# Altium schematic sheet P5_CCD_CAM_BOARD_AFE.SchDoc
size A3
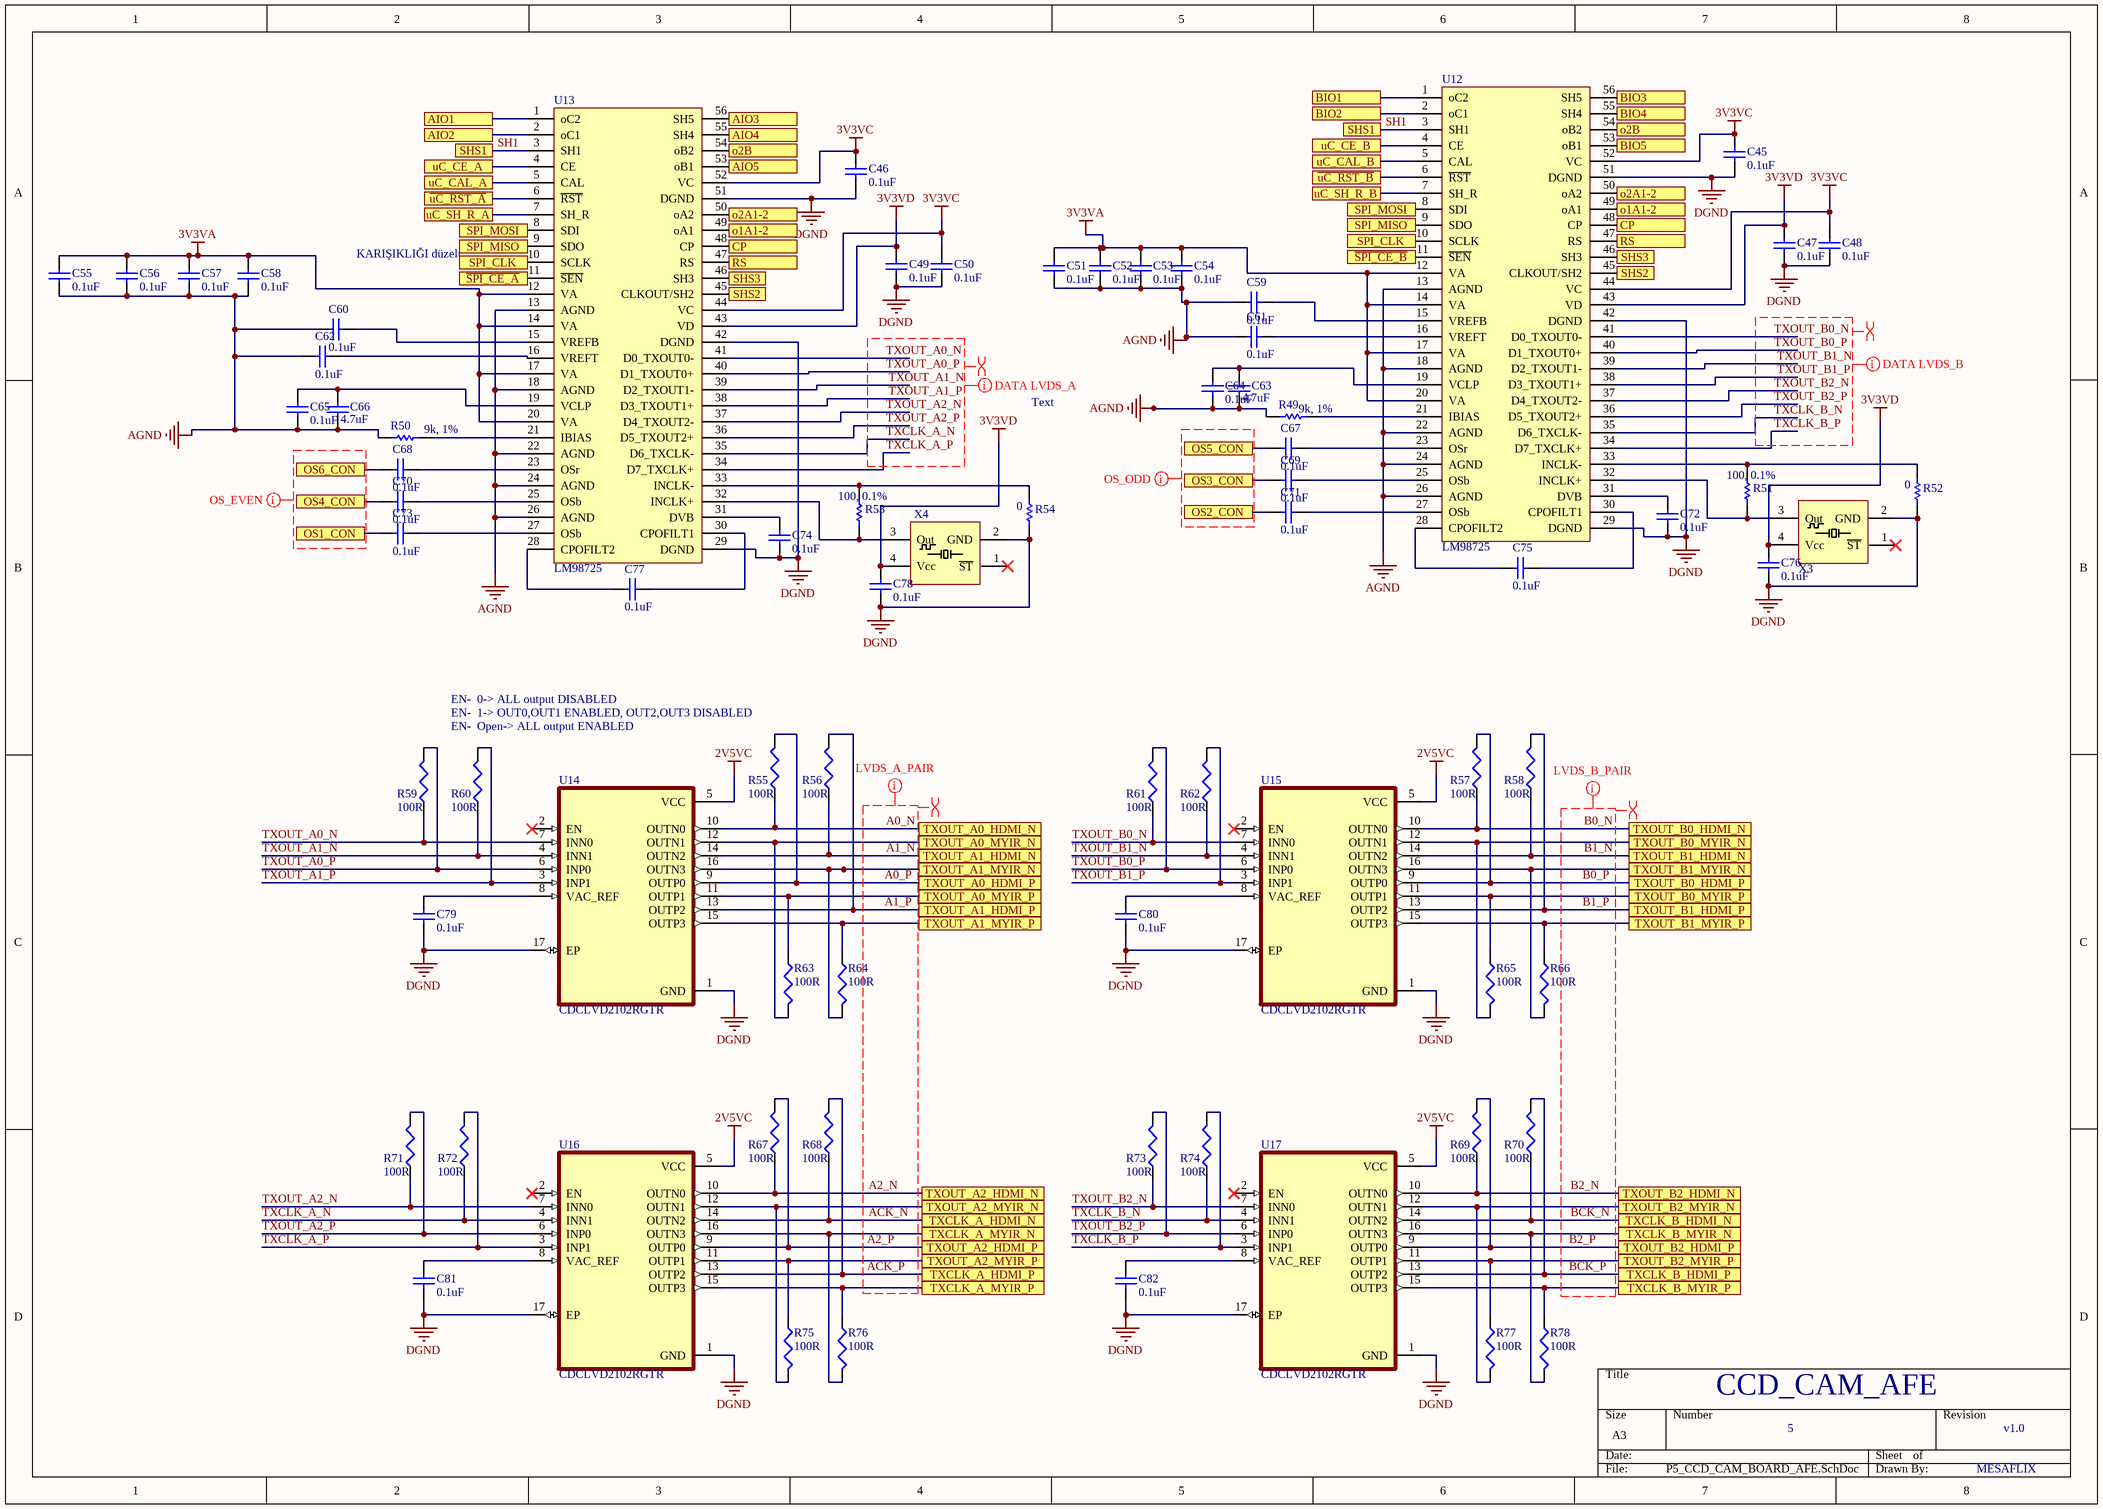
[diagram p0: P5_CCD_CAM_BOARD_AFE.SchDoc]

## Parts
C45  0.1uF  [C 0402(1005)x0.5]
C46  0.1uF  [C 0402(1005)x0.5]
C47  0.1uF  [C 0402(1005)x0.5]
C48  0.1uF  [C 0402(1005)x0.5]
C49  0.1uF  [C 0402(1005)x0.5]
C50  0.1uF  [C 0402(1005)x0.5]
C51  0.1uF  [C 0402(1005)x0.5]
C52  0.1uF  [C 0402(1005)x0.5]
C53  0.1uF  [C 0402(1005)x0.5]
C54  0.1uF  [C 0402(1005)x0.5]
C55  0.1uF  [C 0402(1005)x0.5]
C56  0.1uF  [C 0402(1005)x0.5]
C57  0.1uF  [C 0402(1005)x0.5]
C58  0.1uF  [C 0402(1005)x0.5]
C59  0.1uF  [C 0402(1005)x0.5]
C60  0.1uF  [C 0402(1005)x0.5]
C61  0.1uF  [C 0402(1005)x0.5]
C62  0.1uF  [C 0402(1005)x0.5]
C63  value 4.7uF  [1608[0603]]  (hidden comment: GRM155R71H104KE14J)
C64  0.1uF  [C 0402(1005)x0.5]
C65  0.1uF  [C 0402(1005)x0.5]
C66  value 4.7uF  [1608[0603]]  (hidden comment: GRM155R71H104KE14J)
C67  0.1uF  [C 0402(1005)x0.5]
C68  0.1uF  [C 0402(1005)x0.5]
C69  0.1uF  [C 0402(1005)x0.5]
C70  0.1uF  [C 0402(1005)x0.5]
C71  0.1uF  [C 0402(1005)x0.5]
C72  0.1uF  [C 0402(1005)x0.5]
C73  0.1uF  [C 0402(1005)x0.5]
C74  0.1uF  [C 0402(1005)x0.5]
C75  0.1uF  [C 0402(1005)x0.5]
C76  0.1uF  [C 0402(1005)x0.5]
C77  0.1uF  [C 0402(1005)x0.5]
C78  0.1uF  [C 0402(1005)x0.5]
C79  0.1uF  [C 0402(1005)x0.5]
C80  0.1uF  [C 0402(1005)x0.5]
C81  0.1uF  [C 0402(1005)x0.5]
C82  0.1uF  [C 0402(1005)x0.5]
R49  value 9k, 1%  [0603 (1608)]  (hidden comment: RN731JTTD8981D25)
R50  value 9k, 1%  [0603 (1608)]  (hidden comment: RN731JTTD8981D25)
R51  value 100, 0.1%  [R 0402(1005)]  (hidden comment: RG1005P-101-B-T5)
R52  value 0  [R 0402(1005)]  (hidden comment: ERJ-3GEY0R00V)
R53  value 100, 0.1%  [R 0402(1005)]  (hidden comment: RG1005P-101-B-T5)
R54  value 0  [R 0402(1005)]  (hidden comment: ERJ-3GEY0R00V)
R55  100R  [R 0402(1005)]
R56  100R  [R 0402(1005)]
R57  100R  [R 0402(1005)]
R58  100R  [R 0402(1005)]
R59  100R  [R 0402(1005)]
R60  100R  [R 0402(1005)]
R61  100R  [R 0402(1005)]
R62  100R  [R 0402(1005)]
R63  100R  [R 0402(1005)]
R64  100R  [R 0402(1005)]
R65  100R  [R 0402(1005)]
R66  100R  [R 0402(1005)]
R67  100R  [R 0402(1005)]
R68  100R  [R 0402(1005)]
R69  100R  [R 0402(1005)]
R70  100R  [R 0402(1005)]
R71  100R  [R 0402(1005)]
R72  100R  [R 0402(1005)]
R73  100R  [R 0402(1005)]
R74  100R  [R 0402(1005)]
R75  100R  [R 0402(1005)]
R76  100R  [R 0402(1005)]
R77  100R  [R 0402(1005)]
R78  100R  [R 0402(1005)]
U12  LM98725  [SOP50P810X110-56N]
U13  LM98725  [SOP50P810X110-56N]
U14  CDCLVD2102RGTR  [QFN50P300X300X100-17N]
U15  CDCLVD2102RGTR  [QFN50P300X300X100-17N]
U16  CDCLVD2102RGTR  [QFN50P300X300X100-17N]
U17  CDCLVD2102RGTR  [QFN50P300X300X100-17N]
X3  SG-310SCF 25.0000  [SG-310SCF 25.0000MB3]  (value not drawn)
X4  SG-310SCF 25.0000  [SG-310SCF 25.0000MB3]  (value not drawn)

## Ports
AIO1, AIO2, AIO3, AIO4, AIO5, BIO1, BIO2, BIO3, BIO4, BIO5, CP, o1A1-2, o2A1-2, o2B, OS1_CON, OS2_CON, OS3_CON, OS4_CON, OS5_CON, OS6_CON, RS, SHS1, SHS2, SHS3, SPI_CLK, SPI_MISO, SPI_MOSI, TXCLK_A_HDMI_N, TXCLK_A_HDMI_P, TXCLK_A_MYIR_N, TXCLK_A_MYIR_P, TXCLK_B_HDMI_N, TXCLK_B_HDMI_P, TXCLK_B_MYIR_N, TXCLK_B_MYIR_P, TXOUT_A0_HDMI_N, TXOUT_A0_HDMI_P, TXOUT_A0_MYIR_N, TXOUT_A0_MYIR_P, TXOUT_A1_HDMI_N, TXOUT_A1_HDMI_P, TXOUT_A1_MYIR_N, TXOUT_A1_MYIR_P, TXOUT_A2_HDMI_N, TXOUT_A2_HDMI_P, TXOUT_A2_MYIR_N, TXOUT_A2_MYIR_P, TXOUT_B0_HDMI_N, TXOUT_B0_HDMI_P, TXOUT_B0_MYIR_N, TXOUT_B0_MYIR_P, TXOUT_B1_HDMI_N, TXOUT_B1_HDMI_P, TXOUT_B1_MYIR_N, TXOUT_B1_MYIR_P, TXOUT_B2_HDMI_N, TXOUT_B2_HDMI_P, TXOUT_B2_MYIR_N, TXOUT_B2_MYIR_P, uC_CAL_A, uC_CAL_B, uC_CE_A, uC_CE_B, uC_SH_R_A, uC_SH_R_B, ~{SPI_CE_A}, ~{SPI_CE_B}, ~{uC_RST_A}, ~{uC_RST_B}

## Nets
2V5VC: U14.5(VCC) U15.5(VCC) U16.5(VCC) U17.5(VCC)
3V3VA: C51.2 C52.2 C53.2 C54.2 C55.2 C56.2 C57.2 C58.2 U12.12(VA) U12.14(VA) U12.17(VA) U12.20(VA) U13.12(VA) U13.14(VA) U13.17(VA) U13.20(VA)
3V3VC: C45.2 C46.2 C48.2 C50.2 U12.44(VC) U12.52(VC) U13.44(VC) U13.52(VC)
3V3VD: C47.2 C49.2 C76.2 C78.2 U12.43(VD) U13.43(VD) X3.4(Vcc) X4.4(Vcc)
AGND: C51.1 C52.1 C53.1 C54.1 C55.1 C56.1 C57.1 C58.1 C59.2 C60.2 C61.2 C62.2 C63.1 C64.2 C65.1 C66.1 R49.2 R50.2 U12.13(AGND) U12.18(AGND) U12.22(AGND) U12.24(AGND) U12.26(AGND) U13.13(AGND) U13.18(AGND) U13.22(AGND) U13.24(AGND) U13.26(AGND)
DGND: C45.1 C46.1 C47.1 C48.1 C49.1 C50.1 C72.1 C74.1 C76.1 C78.1 C79.1 C80.1 C81.1 C82.1 R52.2 R54.2 U12.29(DGND) U12.42(DGND) U12.51(DGND) U13.29(DGND) U13.42(DGND) U13.51(DGND) U14.1(GND) U14.17(EP) U15.1(GND) U15.17(EP) U16.1(GND) U16.17(EP) U17.1(GND) U17.17(EP) X3.2(GND) X4.2(GND)
A0_N: R55.1 U14.10(OUTN0) ; port TXOUT_A0_HDMI_N
A0_P: R55.2 U14.9(OUTP0) ; port TXOUT_A0_HDMI_P
A1_N: R56.1 U14.14(OUTN2) ; port TXOUT_A1_HDMI_N
A1_P: R56.2 U14.13(OUTP2) ; port TXOUT_A1_HDMI_P
A2_N: R67.1 U16.10(OUTN0) ; port TXOUT_A2_HDMI_N
A2_P: R67.2 U16.9(OUTP0) ; port TXOUT_A2_HDMI_P
ACK_N: R68.1 U16.14(OUTN2) ; port TXCLK_A_HDMI_N
ACK_P: R68.2 U16.13(OUTP2) ; port TXCLK_A_HDMI_P
AIO1: U13.1(oC2) ; port AIO1
AIO2: U13.2(oC1) ; port AIO2
AIO3: U13.56(SH5) ; port AIO3
AIO4: U13.55(SH4) ; port AIO4
AIO5: U13.53(oB1) ; port AIO5
B0_N: R57.1 U15.10(OUTN0) ; port TXOUT_B0_HDMI_N
B0_P: R57.2 U15.9(OUTP0) ; port TXOUT_B0_HDMI_P
B1_N: R58.1 U15.14(OUTN2) ; port TXOUT_B1_HDMI_N
B1_P: R58.2 U15.13(OUTP2) ; port TXOUT_B1_HDMI_P
B2_N: R69.1 U17.10(OUTN0) ; port TXOUT_B2_HDMI_N
B2_P: R69.2 U17.9(OUTP0) ; port TXOUT_B2_HDMI_P
BCK_N: R70.1 U17.14(OUTN2) ; port TXCLK_B_HDMI_N
BCK_P: R70.2 U17.13(OUTP2) ; port TXCLK_B_HDMI_P
BIO1: U12.1(oC2) ; port BIO1
BIO2: U12.2(oC1) ; port BIO2
BIO3: U12.56(SH5) ; port BIO3
BIO4: U12.55(SH4) ; port BIO4
BIO5: U12.53(oB1) ; port BIO5
CP: U12.48(CP) U13.48(CP) ; port CP
o1A1-2: U12.49(oA1) U13.49(oA1) ; port o1A1-2
o2A1-2: U12.50(oA2) U13.50(oA2) ; port o2A1-2
o2B: U12.54(oB2) U13.54(oB2) ; port o2B
OS1_CON: C73.2 ; port OS1_CON
OS2_CON: C71.2 ; port OS2_CON
OS3_CON: C69.2 ; port OS3_CON
OS4_CON: C70.2 ; port OS4_CON
OS5_CON: C67.2 ; port OS5_CON
OS6_CON: C68.2 ; port OS6_CON
RS: U12.47(RS) U13.47(RS) ; port RS
~{SPI_CE_A}: U13.11(~{SEN}) ; port ~{SPI_CE_A}
~{SPI_CE_B}: U12.11(~{SEN}) ; port ~{SPI_CE_B}
SH1: U12.3(SH1) U13.3(SH1) ; port SHS1
SHS2: U12.45(CLKOUT/SH2) U13.45(CLKOUT/SH2) ; port SHS2
SHS3: U12.46(SH3) U13.46(SH3) ; port SHS3
SPI_CLK: U12.10(SCLK) U13.10(SCLK) ; port SPI_CLK
SPI_MISO: U12.9(SDO) U13.9(SDO) ; port SPI_MISO
SPI_MOSI: U12.8(SDI) U13.8(SDI) ; port SPI_MOSI
TXCLK_A_MYIR_N: R76.2 U16.16(OUTN3) ; port TXCLK_A_MYIR_N
TXCLK_A_MYIR_P: R76.1 U16.15(OUTP3) ; port TXCLK_A_MYIR_P
TXCLK_A_N: R72.1 U13.35(D6_TXCLK-) U16.4(INN1)
TXCLK_A_P: R72.2 U13.34(D7_TXCLK+) U16.3(INP1)
TXCLK_B_MYIR_N: R78.2 U17.16(OUTN3) ; port TXCLK_B_MYIR_N
TXCLK_B_MYIR_P: R78.1 U17.15(OUTP3) ; port TXCLK_B_MYIR_P
TXCLK_B_N: R74.1 U12.35(D6_TXCLK-) U17.4(INN1)
TXCLK_B_P: R74.2 U12.34(D7_TXCLK+) U17.3(INP1)
TXOUT_A0_MYIR_N: R63.2 U14.12(OUTN1) ; port TXOUT_A0_MYIR_N
TXOUT_A0_MYIR_P: R63.1 U14.11(OUTP1) ; port TXOUT_A0_MYIR_P
TXOUT_A0_N: R59.1 U13.41(D0_TXOUT0-) U14.7(INN0)
TXOUT_A0_P: R59.2 U13.40(D1_TXOUT0+) U14.6(INP0)
TXOUT_A1_MYIR_N: R64.2 U14.16(OUTN3) ; port TXOUT_A1_MYIR_N
TXOUT_A1_MYIR_P: R64.1 U14.15(OUTP3) ; port TXOUT_A1_MYIR_P
TXOUT_A1_N: R60.1 U13.39(D2_TXOUT1-) U14.4(INN1)
TXOUT_A1_P: R60.2 U13.38(D3_TXOUT1+) U14.3(INP1)
TXOUT_A2_MYIR_N: R75.2 U16.12(OUTN1) ; port TXOUT_A2_MYIR_N
TXOUT_A2_MYIR_P: R75.1 U16.11(OUTP1) ; port TXOUT_A2_MYIR_P
TXOUT_A2_N: R71.1 U13.37(D4_TXOUT2-) U16.7(INN0)
TXOUT_A2_P: R71.2 U13.36(D5_TXOUT2+) U16.6(INP0)
TXOUT_B0_MYIR_N: R65.2 U15.12(OUTN1) ; port TXOUT_B0_MYIR_N
TXOUT_B0_MYIR_P: R65.1 U15.11(OUTP1) ; port TXOUT_B0_MYIR_P
TXOUT_B0_N: R61.1 U12.41(D0_TXOUT0-) U15.7(INN0)
TXOUT_B0_P: R61.2 U12.40(D1_TXOUT0+) U15.6(INP0)
TXOUT_B1_MYIR_N: R66.2 U15.16(OUTN3) ; port TXOUT_B1_MYIR_N
TXOUT_B1_MYIR_P: R66.1 U15.15(OUTP3) ; port TXOUT_B1_MYIR_P
TXOUT_B1_N: R62.1 U12.39(D2_TXOUT1-) U15.4(INN1)
TXOUT_B1_P: R62.2 U12.38(D3_TXOUT1+) U15.3(INP1)
TXOUT_B2_MYIR_N: R77.2 U17.12(OUTN1) ; port TXOUT_B2_MYIR_N
TXOUT_B2_MYIR_P: R77.1 U17.11(OUTP1) ; port TXOUT_B2_MYIR_P
TXOUT_B2_N: R73.1 U12.37(D4_TXOUT2-) U17.7(INN0)
TXOUT_B2_P: R73.2 U12.36(D5_TXOUT2+) U17.6(INP0)
~{uC_RST_A}: U13.6(~{RST}) ; port ~{uC_RST_A}
~{uC_RST_B}: U12.6(~{RST}) ; port ~{uC_RST_B}
uC_CAL_A: U13.5(CAL) ; port uC_CAL_A
uC_CAL_B: U12.5(CAL) ; port uC_CAL_B
uC_CE_A: U13.4(CE) ; port uC_CE_A
uC_CE_B: U12.4(CE) ; port uC_CE_B
uC_SH_R_A: U13.7(SH_R) ; port uC_SH_R_A
uC_SH_R_B: U12.7(SH_R) ; port uC_SH_R_B
NetC59_1: C59.1 U12.15(VREFB)
NetC60_1: C60.1 U13.15(VREFB)
NetC61_1: C61.1 U12.16(VREFT)
NetC62_1: C62.1 U13.16(VREFT)
NetC63_2: C63.2 C64.1 U12.19(VCLP)
NetC65_2: C65.2 C66.2 U13.19(VCLP)
NetC67_1: C67.1 U12.23(OSr)
NetC68_1: C68.1 U13.23(OSr)
NetC69_1: C69.1 U12.25(OSb)
NetC70_1: C70.1 U13.25(OSb)
NetC71_1: C71.1 U12.27(OSb)
NetC72_2: C72.2 U12.31(DVB)
NetC73_1: C73.1 U13.27(OSb)
NetC74_2: C74.2 U13.31(DVB)
NetC75_1: C75.1 U12.30(CPOFILT1)
NetC75_2: C75.2 U12.28(CPOFILT2)
NetC77_1: C77.1 U13.30(CPOFILT1)
NetC77_2: C77.2 U13.28(CPOFILT2)
NetC79_2: C79.2 U14.8(VAC_REF)
NetC80_2: C80.2 U15.8(VAC_REF)
NetC81_2: C81.2 U16.8(VAC_REF)
NetC82_2: C82.2 U17.8(VAC_REF)
NetR49_1: R49.1 U12.21(IBIAS)
NetR50_1: R50.1 U13.21(IBIAS)
NetR51_1: R51.1 R52.1 U12.33(INCLK-)
NetR51_2: R51.2 U12.32(INCLK+) X3.3(Out)
NetR53_1: R53.1 R54.1 U13.33(INCLK-)
NetR53_2: R53.2 U13.32(INCLK+) X4.3(Out)

Not connected (* = marked no-connect by the designer): U14 2(EN)*; U15 2(EN)*; U16 2(EN)*; U17 2(EN)*; X3 1(~{ST})*; X4 1(~{ST})*

## Layout directives
rule Matched Net Lengths [Tolerance = 0.05mm]; net class DATA_LVDS: TXCLK_A_N, TXCLK_A_P, TXCLK_B_N, TXCLK_B_P, TXOUT_A0_N, TXOUT_A0_P, TXOUT_A1_N, TXOUT_A1_P, TXOUT_A2_N, TXOUT_A2_P, TXOUT_B0_N, TXOUT_B0_P, TXOUT_B1_N, TXOUT_B1_P, TXOUT_B2_N, TXOUT_B2_P
rule Matched Net Lengths [Tolerance = 0.05mm]; net class oses: (no net found under the mark)
differential pair: A0_N, A0_P, A1_N, A1_P, A2_N, A2_P, ACK_N, ACK_P, B0_N, B0_P, B1_N, B1_P, B2_N, B2_P, BCK_N, BCK_P, TXCLK_A_N, TXCLK_A_P, TXCLK_B_N, TXCLK_B_P, TXOUT_A0_N, TXOUT_A0_P, TXOUT_A1_N, TXOUT_A1_P, TXOUT_A2_N, TXOUT_A2_P, TXOUT_B0_N, TXOUT_B0_P, TXOUT_B1_N, TXOUT_B1_P, TXOUT_B2_N, TXOUT_B2_P
mark named LVDS_A_PAIR: A0_N, A0_P, A1_N, A1_P, A2_N, A2_P, ACK_N, ACK_P
mark named LVDS_B_PAIR: B0_N, B0_P, B1_N, B1_P, B2_N, B2_P, BCK_N, BCK_P

## Notes on the sheet
- KARIŞIKLIĞI düzelt
- Text
- EN-  1-> OUT0,OUT1 ENABLED, OUT2,OUT3 DISABLED
- EN-  0-> ALL output DISABLED
- EN-  Open-> ALL output ENABLED
- CCD_CAM_AFE
- 5
- v1.0
- MESAFLIX

## Library data of the parts
C45-C62 C64 C65 C67-C82 = Cap: Capacitor; Manufacturer: Murata; Manufacturer Part Number: GRM155R71C104KA88D; Material: Ceramic; Capacitance: 100nF; Tolerance: 10%; Dielectric: X7R; Voltage Rating: 16V; Insulation Resistance: 10GR; Supplier 1: Digi-Key; Supplier Part Number 1: 490-3261-6-ND; Stock 1: 141162259; Pricing 1: 1 = 0,10000, 10 = 0,03300, 100 = 0,01470, 500 = 0,01046, 1000 = 0,00822, 2500 = 0,00748, 5000 = 0,00688 (USD); RoHS: Yes; Mount: Surface Mount; Case/Package: 0402; Number of Pins: 2; Case Code (Metric): 1005; Case Code (Imperial): 0402; Dielectric Material: Ceramic; Min Operating Temperature: -55°C; Max Operating Temperature: 125°C; Packaging: Tape and Reel; Voltage Rating (DC): 16V; Package Quantity: 1; Termination: SMD/SMT; Voltage: 16V; Length: 1mm; Height: 0.5mm; Width: 0.5mm; Thickness: 0.022inch; Depth: 0.5mm; Radiation Hardening: No; REACH SVHC: No SVHC; Lead Free: Lead Free; ComponentLink1URL: https://datasheet.ciiva.com/18102/getdatasheetpartid-85307-18102905.pdf?src-supplier=Verical; ComponentLink1Description: https://datasheet.ciiva.com/18102/getdatasheetpartid-85307-18102905.pdf?src-supplier=Verical; ComponentLink2URL: https://datasheet.ciiva.com/129/grm155r71c104ka88-01-129739.pdf?src-supplier=Digi-Key; ComponentLink2Description: https://datasheet.ciiva.com/129/grm155r71c104ka88-01-129739.pdf?src-supplier=Digi-Key; ComponentLink3URL: https://datasheet.ciiva.com/129/grm155r71c104ka88-01-129740.pdf?src-supplier=Digi-Key; ComponentLink3Description: https://datasheet.ciiva.com/129/grm155r71c104ka88-01-129740.pdf?src-supplier=Digi-Key; ComponentLink4URL: https://datasheet.ciiva.com/29199/454098-da-01-en-vs-kondensator-0402-29199799.pdf?src-supplier=Conrad; ComponentLink4Description: https://datasheet.ciiva.com/29199/454098-da-01-en-vs-kondensator-0402-29199799.pdf?src-supplier=Conrad; ComponentLink5URL: https://datasheet.ciiva.com/28534/4360-28534133.pdf?src-supplier=Element14; ComponentLink5Description: https://datasheet.ciiva.com/28534/4360-28534133.pdf?src-supplier=Element14; ComponentLink6URL: https://datasheet.ciiva.com/14103/grmseries-highdielectrictype-eng-14103750.pdf?src-supplier=Distrelec; ComponentLink6Description: https://datasheet.ciiva.com/14103/grmseries-highdielectrictype-eng-14103750.pdf?src-supplier=Distrelec; ComponentLink7URL: https://datasheet.ciiva.com/16199/product-16199000.pdf?src-supplier=Future+Electronics; ComponentLink7Description: https://datasheet.ciiva.com/16199/product-16199000.pdf?src-supplier=Future+Electronics; ComponentLink8URL: https://datasheet.ciiva.com/14116/grmseries-highdielectrictype-eng-14116878.pdf?src-supplier=Distrelec; ComponentLink8Description: https://datasheet.ciiva.com/14116/grmseries-highdielectrictype-eng-14116878.pdf?src-supplier=Distrelec; ComponentLink9URL: https://datasheet.ciiva.com/7937/4360-7937615.pdf?src-supplier=Element14; ComponentLink9Description: https://datasheet.ciiva.com/7937/4360-7937615.pdf?src-supplier=Element14; ComponentLink10URL: https://datasheet.ciiva.com/28534/4360-28534127.pdf?src-supplier=Element14; ComponentLink10Description: https://datasheet.ciiva.com/28534/4360-28534127.pdf?src-supplier=Element14
C63 C66 = Cap: Capacitor; Mfr Part #: CL10A475KA8NQNC
R49 R50 = Res Semi: Semiconductor Resistor; Mfr Part #: RN73H1ETTP8981F25
R51 R53 = Res Semi: RES SMD 100 OHM 0.1% 1/16W 0402; Mfr Part #: RG1005P-101-B-T5
R52 R54 = Res Semi: Semiconductor Resistor; Mfr Part #: RC0603JR-070RL
R55-R78 = RES0603_100R: RES SMD 100R OHM 1% 1/10W 0603; Order Code: DIGI : RMCF0603FT100RCT-ND; P/N: RMCF0603FT100R; ART Code: ART0022201; Value: 100R
U14-U17 = CDCLVD2102RGTR: Low Jitter, Dual 1:2 Universal-to-LVDS Buffer 16-VQFN -40 to 85; MF: Texas Instruments; MP: CDCLVD2102RGTR; Package: VQFN-16 Texas Instruments; SnapEDA_Link: https://www.snapeda.com/parts/CDCLVD2102RGTR/Texas%20Instruments/view-part/1060724/?ref=snap; Check_prices: https://www.snapeda.com/parts/CDCLVD2102RGTR/Texas%20Instruments/view-part/1060724/?ref=eda; Value: *; Digi-Key_Part_Number: 296-CDCLVD2102RGCT-ND
X3 X4 = SG-310SCF 25.0000: Ceramic Base SMD Crystal 25MHz, 18pf
U12 U13 = LM98725: Mfr Part #: LM98725